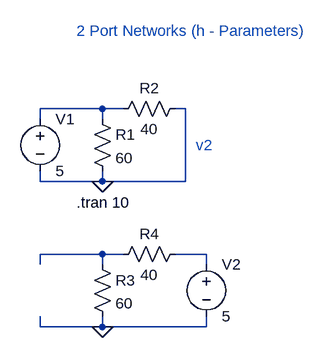
[diagram p0: schematic Lab7_ques1.asc]
Lab7_ques1.asc, the LTspice schematic file:
Version 4
SHEET 1 880 1008
WIRE 96 160 0 160
WIRE 128 160 96 160
WIRE 224 160 208 160
WIRE 0 176 0 160
WIRE 96 176 96 160
WIRE 0 272 0 256
WIRE 96 272 96 256
WIRE 96 272 0 272
WIRE 224 272 224 160
WIRE 224 272 96 272
WIRE 96 384 0 384
WIRE 128 384 96 384
WIRE 256 384 208 384
WIRE 0 400 0 384
WIRE 96 400 96 384
WIRE 256 400 256 384
WIRE 0 496 0 480
WIRE 96 496 96 480
WIRE 96 496 0 496
WIRE 256 496 256 480
WIRE 256 496 96 496
FLAG 96 272 0
FLAG 96 496 0
SYMBOL Res 80 160 R0
SYMATTR InstName R1
SYMATTR Value 60
SYMBOL Res 224 144 R90
WINDOW 0 0 56 VBottom 2
WINDOW 3 32 56 VTop 2
SYMATTR InstName R2
SYMATTR Value 40
SYMBOL voltage 0 160 R0
SYMATTR InstName V1
SYMATTR Value 5
SYMBOL Res 80 384 R0
SYMATTR InstName R3
SYMATTR Value 60
SYMBOL Res 224 368 R90
WINDOW 0 0 56 VBottom 2
WINDOW 3 32 56 VTop 2
SYMATTR InstName R4
SYMATTR Value 40
SYMBOL Voltage 256 384 R0
SYMATTR InstName V2
SYMATTR Value 5
TEXT 56 40 Left 2 ;2 Port Networks (h - Parameters)
TEXT 56 304 Left 2 !.tran 10
TEXT 240 216 Left 2 ;v2

The netlist it stands for:
* Lab7_ques1.asc
R1 N001 0 60
R2 0 N001 40
V1 N001 0 5
R3 N002 0 60
R4 N003 N002 40
V2 N003 0 5
* 2 Port Networks (h - Parameters)
.tran 10
* v2
.backanno
.end